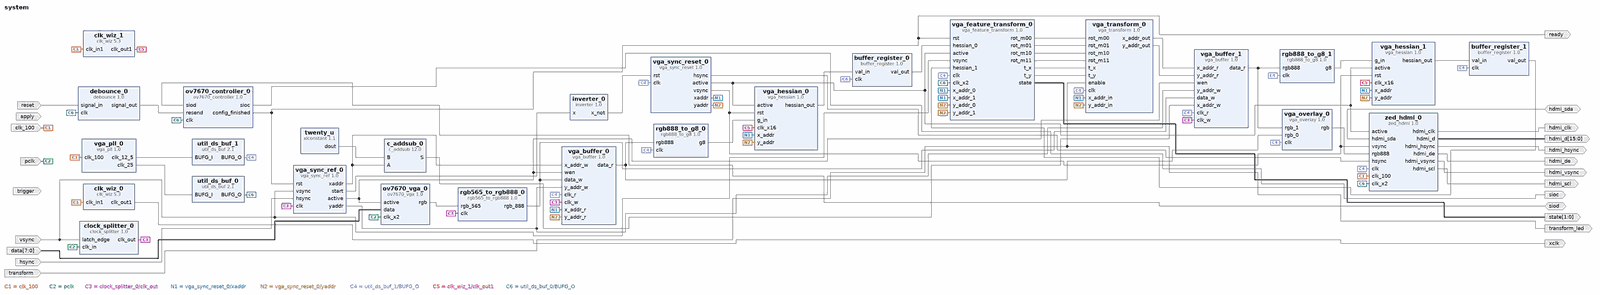
[diagram p0: block diagram of the top level, whole]
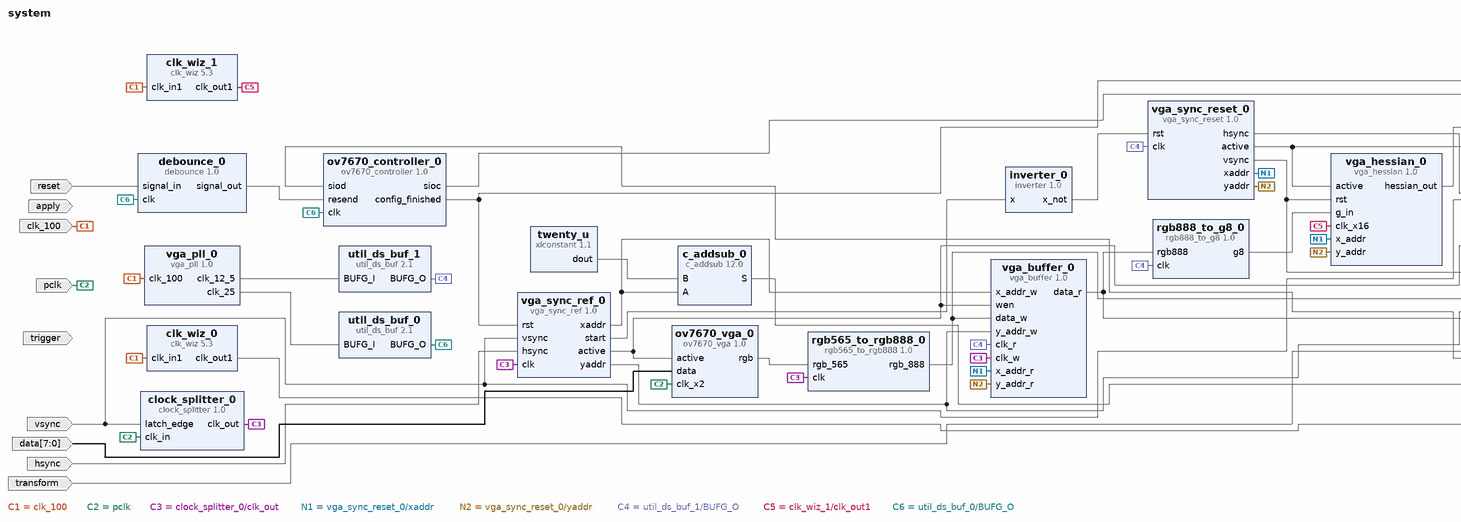
[diagram p1: block diagram of the top level, left part]
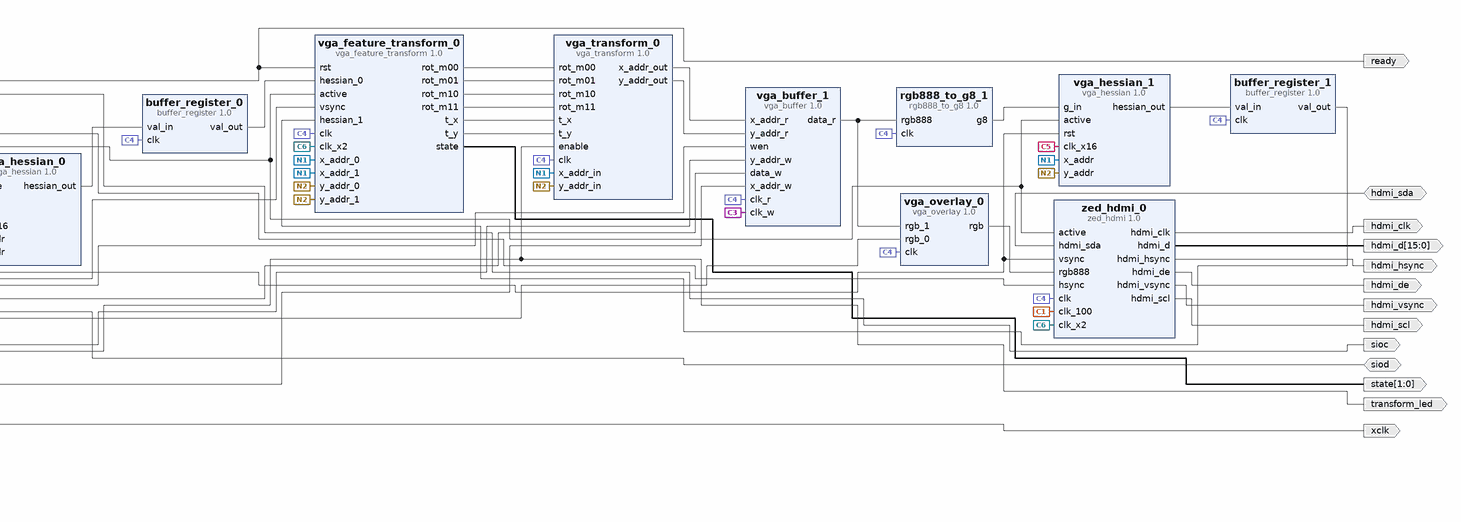
[diagram p2: block diagram of the top level, right part]
# Vivado block design system, xc7z020clg484-1, Vivado 2016.4
create_bd_design system

create_bd_port -dir I trigger
create_bd_port -dir I apply
create_bd_port -dir O -type clk hdmi_clk
create_bd_port -dir O hdmi_hsync
create_bd_port -dir O hdmi_vsync
create_bd_port -dir O -from 15 -to 0 hdmi_d
create_bd_port -dir O hdmi_de
create_bd_port -dir O hdmi_scl
create_bd_port -dir IO hdmi_sda
create_bd_port -dir I clk_100
create_bd_port -dir O ready
create_bd_port -dir O sioc
create_bd_port -dir IO siod
create_bd_port -dir I -from 7 -to 0 data
create_bd_port -dir I hsync
create_bd_port -dir I vsync
create_bd_port -dir O xclk
create_bd_port -dir I reset
create_bd_port -dir I pclk
create_bd_port -dir I transform
create_bd_port -dir O transform_led
create_bd_port -dir O -from 1 -to 0 state

create_bd_cell -type ip -vlnv xilinx.com:user:ov7670_controller:1.0 ov7670_controller_0
create_bd_cell -type ip -vlnv xilinx.com:user:zed_hdmi:1.0 zed_hdmi_0
create_bd_cell -type ip -vlnv xilinx.com:user:rgb565_to_rgb888:1.0 rgb565_to_rgb888_0
create_bd_cell -type ip -vlnv xilinx.com:user:vga_buffer:1.0 vga_buffer_0
set_property -dict {CONFIG.SIZE_POW2 12} [get_bd_cells vga_buffer_0]
create_bd_cell -type ip -vlnv user.org:user:inverter:1.0 inverter_0
create_bd_cell -type ip -vlnv xilinx.com:user:vga_sync_ref:1.0 vga_sync_ref_0
create_bd_cell -type ip -vlnv xilinx.com:user:debounce:1.0 debounce_0
create_bd_cell -type ip -vlnv xilinx.com:user:ov7670_vga:1.0 ov7670_vga_0
create_bd_cell -type ip -vlnv xilinx.com:user:clock_splitter:1.0 clock_splitter_0
create_bd_cell -type ip -vlnv xilinx.com:user:vga_buffer:1.0 vga_buffer_1
set_property -dict {CONFIG.SIZE_POW2 12} [get_bd_cells vga_buffer_1]
create_bd_cell -type ip -vlnv xilinx.com:user:vga_overlay:1.0 vga_overlay_0
create_bd_cell -type ip -vlnv xilinx.com:user:rgb888_to_g8:1.0 rgb888_to_g8_0
create_bd_cell -type ip -vlnv xilinx.com:ip:clk_wiz:5.3 clk_wiz_0
set_property -dict [list \
  CONFIG.CLKOUT2_USED false \
  CONFIG.CLKOUT3_USED false \
  CONFIG.NUM_OUT_CLKS 1 \
  CONFIG.CLKOUT1_REQUESTED_OUT_FREQ 11.9 \
  CONFIG.CLKOUT2_REQUESTED_OUT_FREQ 25.000 \
  CONFIG.CLKOUT3_REQUESTED_OUT_FREQ 12.500 \
  CONFIG.USE_LOCKED false \
  CONFIG.USE_RESET false \
  CONFIG.MMCM_DIVCLK_DIVIDE 5 \
  CONFIG.MMCM_CLKFBOUT_MULT_F 44.625 \
  CONFIG.MMCM_CLKOUT0_DIVIDE_F 75.000 \
  CONFIG.MMCM_CLKOUT1_DIVIDE 1 \
  CONFIG.MMCM_CLKOUT2_DIVIDE 1 \
  CONFIG.CLKOUT1_JITTER 394.277 \
  CONFIG.CLKOUT1_PHASE_ERROR 301.475 \
  CONFIG.CLKOUT2_JITTER 187.231 \
  CONFIG.CLKOUT2_PHASE_ERROR 113.618 \
  CONFIG.CLKOUT3_JITTER 214.692 \
  CONFIG.CLKOUT3_PHASE_ERROR 113.618 \
] [get_bd_cells clk_wiz_0]
create_bd_cell -type ip -vlnv xilinx.com:ip:clk_wiz:5.3 clk_wiz_1
set_property -dict [list \
  CONFIG.PRIMITIVE PLL \
  CONFIG.CLKOUT2_USED false \
  CONFIG.CLKOUT3_USED false \
  CONFIG.NUM_OUT_CLKS 1 \
  CONFIG.CLKOUT1_REQUESTED_OUT_FREQ 200.000 \
  CONFIG.CLKOUT2_REQUESTED_OUT_FREQ 25.000 \
  CONFIG.CLKOUT3_REQUESTED_OUT_FREQ 12.500 \
  CONFIG.CLKOUT1_DRIVES BUFG \
  CONFIG.CLKOUT2_DRIVES BUFG \
  CONFIG.CLKOUT3_DRIVES BUFG \
  CONFIG.CLKOUT4_DRIVES BUFG \
  CONFIG.CLKOUT5_DRIVES BUFG \
  CONFIG.CLKOUT6_DRIVES BUFG \
  CONFIG.CLKOUT7_DRIVES BUFG \
  CONFIG.USE_LOCKED false \
  CONFIG.USE_RESET false \
  CONFIG.MMCM_DIVCLK_DIVIDE 1 \
  CONFIG.MMCM_CLKFBOUT_MULT_F 10 \
  CONFIG.MMCM_COMPENSATION ZHOLD \
  CONFIG.MMCM_CLKOUT0_DIVIDE_F 5 \
  CONFIG.MMCM_CLKOUT1_DIVIDE 1 \
  CONFIG.MMCM_CLKOUT2_DIVIDE 1 \
  CONFIG.CLKOUT1_JITTER 114.829 \
  CONFIG.CLKOUT2_JITTER 175.402 \
  CONFIG.CLKOUT2_PHASE_ERROR 98.575 \
  CONFIG.CLKOUT3_JITTER 200.764 \
  CONFIG.CLKOUT3_PHASE_ERROR 98.575 \
] [get_bd_cells clk_wiz_1]
create_bd_cell -type ip -vlnv xilinx.com:ip:xlconstant:1.1 twenty_u
set_property -dict {CONFIG.CONST_WIDTH 10 CONFIG.CONST_VAL 20} [get_bd_cells twenty_u]
create_bd_cell -type ip -vlnv xilinx.com:user:vga_transform:1.0 vga_transform_0
create_bd_cell -type ip -vlnv xilinx.com:user:rgb888_to_g8:1.0 rgb888_to_g8_1
create_bd_cell -type ip -vlnv xilinx.com:user:vga_pll:1.0 vga_pll_0
create_bd_cell -type ip -vlnv xilinx.com:ip:c_addsub:12.0 c_addsub_0
set_property -dict [list \
  CONFIG.A_Width 10 \
  CONFIG.B_Width 10 \
  CONFIG.Out_Width 10 \
  CONFIG.Latency 0 \
  CONFIG.B_Value 0000000000 \
  CONFIG.CE false \
] [get_bd_cells c_addsub_0]
create_bd_cell -type ip -vlnv xilinx.com:user:vga_hessian:1.0 vga_hessian_0
create_bd_cell -type ip -vlnv xilinx.com:user:vga_hessian:1.0 vga_hessian_1
create_bd_cell -type ip -vlnv xilinx.com:user:vga_sync_reset:1.0 vga_sync_reset_0
create_bd_cell -type ip -vlnv xilinx.com:user:vga_feature_transform:1.0 vga_feature_transform_0
create_bd_cell -type ip -vlnv xilinx.com:user:buffer_register:1.0 buffer_register_0
create_bd_cell -type ip -vlnv xilinx.com:user:buffer_register:1.0 buffer_register_1
create_bd_cell -type ip -vlnv xilinx.com:ip:util_ds_buf:2.1 util_ds_buf_0
set_property -dict {CONFIG.C_BUF_TYPE BUFG} [get_bd_cells util_ds_buf_0]
create_bd_cell -type ip -vlnv xilinx.com:ip:util_ds_buf:2.1 util_ds_buf_1
set_property -dict {CONFIG.C_BUF_TYPE BUFG} [get_bd_cells util_ds_buf_1]

# ---- connections ----

connect_bd_net [get_bd_pins zed_hdmi_0/hdmi_clk] [get_bd_ports hdmi_clk]
connect_bd_net [get_bd_pins zed_hdmi_0/hdmi_hsync] [get_bd_ports hdmi_hsync]
connect_bd_net [get_bd_pins zed_hdmi_0/hdmi_vsync] [get_bd_ports hdmi_vsync]
connect_bd_net [get_bd_pins zed_hdmi_0/hdmi_d] [get_bd_ports hdmi_d]
connect_bd_net [get_bd_pins zed_hdmi_0/hdmi_de] [get_bd_ports hdmi_de]
connect_bd_net [get_bd_pins zed_hdmi_0/hdmi_scl] [get_bd_ports hdmi_scl]
connect_bd_net [get_bd_ports hdmi_sda] [get_bd_pins zed_hdmi_0/hdmi_sda]
connect_bd_net -net clk_100_1 [get_bd_ports clk_100] \
  [get_bd_pins zed_hdmi_0/clk_100] [get_bd_pins clk_wiz_0/clk_in1] [get_bd_pins clk_wiz_1/clk_in1] \
  [get_bd_pins vga_pll_0/clk_100]
connect_bd_net [get_bd_pins ov7670_controller_0/config_finished] \
  [get_bd_ports ready] [get_bd_pins vga_sync_ref_0/rst] [get_bd_pins vga_feature_transform_0/rst]
connect_bd_net [get_bd_pins ov7670_controller_0/sioc] [get_bd_ports sioc]
connect_bd_net [get_bd_ports siod] [get_bd_pins ov7670_controller_0/siod]
connect_bd_net [get_bd_ports data] [get_bd_pins ov7670_vga_0/data]
connect_bd_net [get_bd_pins ov7670_vga_0/rgb] [get_bd_pins rgb565_to_rgb888_0/rgb_565]
connect_bd_net [get_bd_ports hsync] [get_bd_pins vga_sync_ref_0/hsync]
connect_bd_net [get_bd_ports vsync] \
  [get_bd_pins vga_sync_ref_0/vsync] [get_bd_pins clock_splitter_0/latch_edge] [get_bd_pins vga_feature_transform_0/vsync]
connect_bd_net [get_bd_pins vga_sync_ref_0/active] [get_bd_pins vga_buffer_0/wen] [get_bd_pins ov7670_vga_0/active] [get_bd_pins vga_buffer_1/wen]
connect_bd_net [get_bd_pins vga_pll_0/clk_25] [get_bd_pins util_ds_buf_0/BUFG_I]
connect_bd_net [get_bd_pins vga_sync_reset_0/hsync] [get_bd_pins zed_hdmi_0/hsync]
connect_bd_net [get_bd_pins vga_sync_reset_0/active] \
  [get_bd_pins zed_hdmi_0/active] [get_bd_pins vga_hessian_0/active] [get_bd_pins vga_hessian_1/active] \
  [get_bd_pins vga_feature_transform_0/active]
connect_bd_net [get_bd_pins clk_wiz_0/clk_out1] [get_bd_ports xclk]
connect_bd_net [get_bd_pins vga_sync_ref_0/xaddr] [get_bd_pins vga_buffer_0/x_addr_w] [get_bd_pins c_addsub_0/A]
connect_bd_net [get_bd_pins vga_sync_ref_0/yaddr] [get_bd_pins vga_buffer_0/y_addr_w] [get_bd_pins vga_buffer_1/y_addr_w]
connect_bd_net [get_bd_pins vga_sync_ref_0/start] [get_bd_pins inverter_0/x]
connect_bd_net [get_bd_pins rgb565_to_rgb888_0/rgb_888] [get_bd_pins vga_buffer_0/data_w] [get_bd_pins vga_buffer_1/data_w]
connect_bd_net -net debounce_0_o [get_bd_pins debounce_0/signal_out] [get_bd_pins ov7670_controller_0/resend]
connect_bd_net [get_bd_ports reset] [get_bd_pins debounce_0/signal_in]
connect_bd_net [get_bd_ports pclk] [get_bd_pins ov7670_vga_0/clk_x2] [get_bd_pins clock_splitter_0/clk_in]
connect_bd_net [get_bd_pins clock_splitter_0/clk_out] \
  [get_bd_pins vga_sync_ref_0/clk] [get_bd_pins rgb565_to_rgb888_0/clk] [get_bd_pins vga_buffer_0/clk_w] \
  [get_bd_pins vga_buffer_1/clk_w]
connect_bd_net [get_bd_pins rgb888_to_g8_0/g8] [get_bd_pins vga_hessian_0/g_in]
connect_bd_net [get_bd_pins vga_feature_transform_0/rot_m00] [get_bd_pins vga_transform_0/rot_m00]
connect_bd_net [get_bd_pins vga_feature_transform_0/rot_m01] [get_bd_pins vga_transform_0/rot_m01]
connect_bd_net [get_bd_pins vga_feature_transform_0/rot_m10] [get_bd_pins vga_transform_0/rot_m10]
connect_bd_net [get_bd_pins vga_feature_transform_0/rot_m11] [get_bd_pins vga_transform_0/rot_m11]
connect_bd_net [get_bd_pins vga_feature_transform_0/t_x] [get_bd_pins vga_transform_0/t_x]
connect_bd_net [get_bd_pins vga_feature_transform_0/t_y] [get_bd_pins vga_transform_0/t_y]
connect_bd_net [get_bd_pins twenty_u/dout] [get_bd_pins c_addsub_0/B]
connect_bd_net [get_bd_ports transform] [get_bd_ports transform_led] [get_bd_pins vga_transform_0/enable]
connect_bd_net [get_bd_pins vga_transform_0/x_addr_out] [get_bd_pins vga_buffer_1/x_addr_r]
connect_bd_net [get_bd_pins vga_transform_0/y_addr_out] [get_bd_pins vga_buffer_1/y_addr_r]
connect_bd_net [get_bd_pins vga_sync_reset_0/xaddr] \
  [get_bd_pins vga_buffer_0/x_addr_r] [get_bd_pins vga_transform_0/x_addr_in] [get_bd_pins vga_hessian_0/x_addr] \
  [get_bd_pins vga_hessian_1/x_addr] [get_bd_pins vga_feature_transform_0/x_addr_0] \
  [get_bd_pins vga_feature_transform_0/x_addr_1]
connect_bd_net [get_bd_pins vga_sync_reset_0/yaddr] \
  [get_bd_pins vga_buffer_0/y_addr_r] [get_bd_pins vga_transform_0/y_addr_in] [get_bd_pins vga_hessian_0/y_addr] \
  [get_bd_pins vga_hessian_1/y_addr] [get_bd_pins vga_feature_transform_0/y_addr_0] \
  [get_bd_pins vga_feature_transform_0/y_addr_1]
connect_bd_net [get_bd_pins vga_sync_reset_0/vsync] [get_bd_pins zed_hdmi_0/vsync] [get_bd_pins vga_hessian_0/rst] [get_bd_pins vga_hessian_1/rst]
connect_bd_net [get_bd_pins vga_overlay_0/rgb] [get_bd_pins zed_hdmi_0/rgb888]
connect_bd_net [get_bd_pins rgb888_to_g8_1/g8] [get_bd_pins vga_hessian_1/g_in]
connect_bd_net [get_bd_pins vga_buffer_0/data_r] [get_bd_pins rgb888_to_g8_0/rgb888] [get_bd_pins vga_overlay_0/rgb_0]
connect_bd_net [get_bd_pins vga_buffer_1/data_r] [get_bd_pins rgb888_to_g8_1/rgb888] [get_bd_pins vga_overlay_0/rgb_1]
connect_bd_net -net vga_pll_0_clk_12_5 [get_bd_pins util_ds_buf_1/BUFG_O] \
  [get_bd_pins zed_hdmi_0/clk] [get_bd_pins vga_buffer_0/clk_r] [get_bd_pins vga_buffer_1/clk_r] \
  [get_bd_pins vga_overlay_0/clk] [get_bd_pins vga_transform_0/clk] [get_bd_pins rgb888_to_g8_1/clk] \
  [get_bd_pins rgb888_to_g8_0/clk] [get_bd_pins vga_sync_reset_0/clk] [get_bd_pins vga_feature_transform_0/clk] \
  [get_bd_pins buffer_register_1/clk] [get_bd_pins buffer_register_0/clk]
connect_bd_net [get_bd_pins inverter_0/x_not] [get_bd_pins vga_sync_reset_0/rst]
connect_bd_net [get_bd_pins c_addsub_0/S] [get_bd_pins vga_buffer_1/x_addr_w]
connect_bd_net [get_bd_pins clk_wiz_1/clk_out1] [get_bd_pins vga_hessian_0/clk_x16] [get_bd_pins vga_hessian_1/clk_x16]
connect_bd_net [get_bd_pins vga_feature_transform_0/state] [get_bd_ports state]
# net trigger_1 has one end: trigger
connect_bd_net [get_bd_pins vga_hessian_0/hessian_out] [get_bd_pins buffer_register_0/val_in]
connect_bd_net [get_bd_pins buffer_register_0/val_out] [get_bd_pins vga_feature_transform_0/hessian_0]
connect_bd_net [get_bd_pins vga_hessian_1/hessian_out] [get_bd_pins buffer_register_1/val_in]
connect_bd_net [get_bd_pins buffer_register_1/val_out] [get_bd_pins vga_feature_transform_0/hessian_1]
connect_bd_net [get_bd_pins util_ds_buf_0/BUFG_O] \
  [get_bd_pins vga_feature_transform_0/clk_x2] [get_bd_pins zed_hdmi_0/clk_x2] [get_bd_pins ov7670_controller_0/clk] \
  [get_bd_pins debounce_0/clk]
connect_bd_net [get_bd_pins vga_pll_0/clk_12_5] [get_bd_pins util_ds_buf_1/BUFG_I]

validate_bd_design
save_bd_design
